# EAGLE schematic f103Ard (EAGLE 4.13)
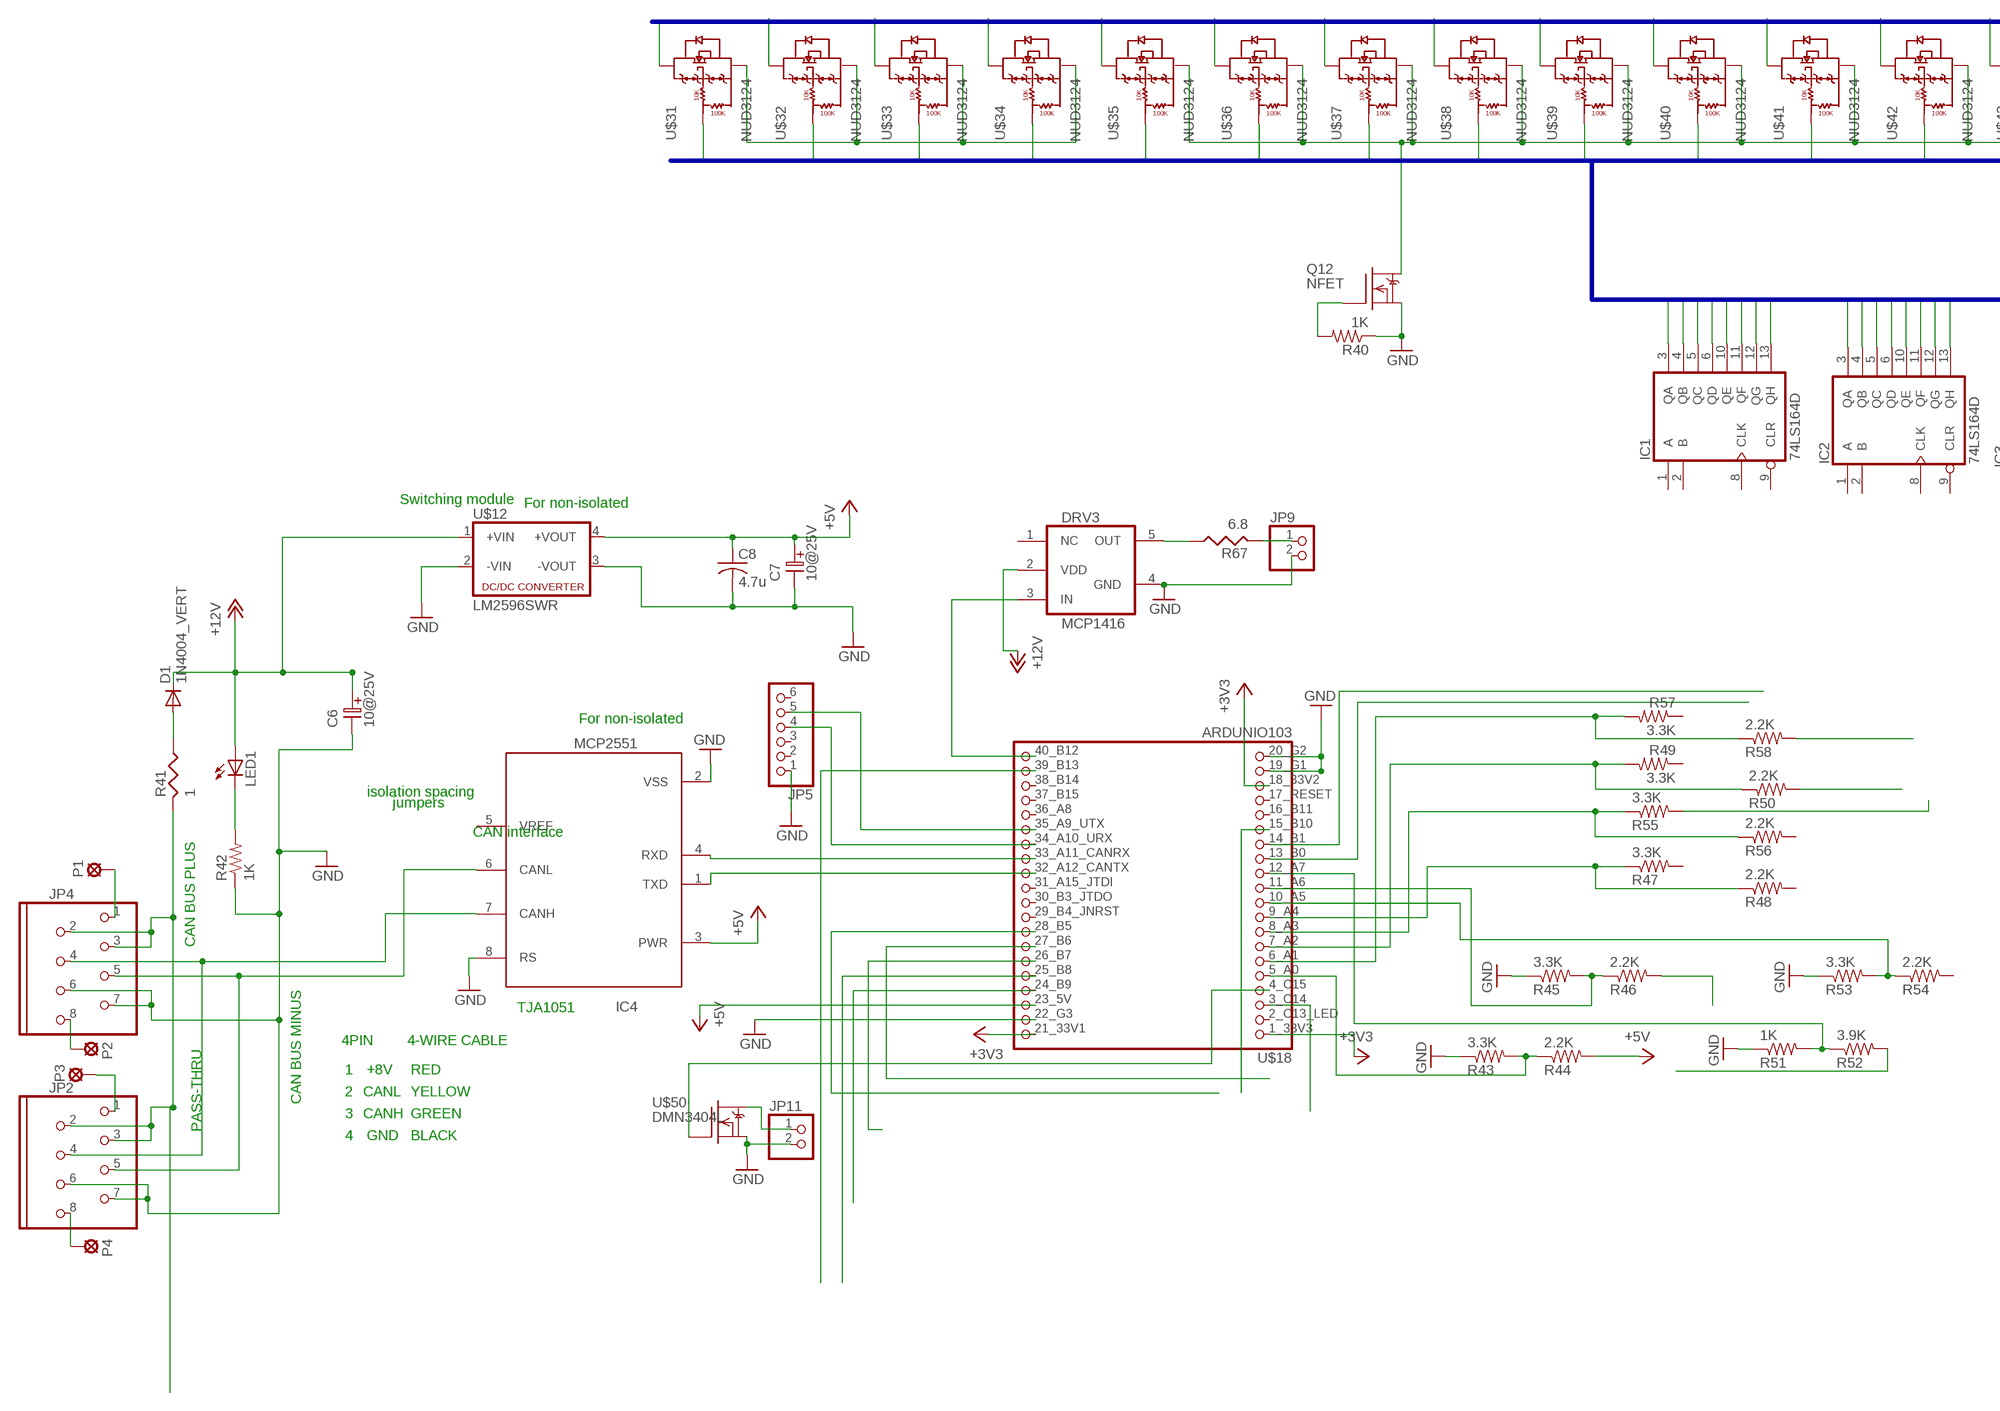
[diagram p0: schematic, sheet 1, part 1 of 2]
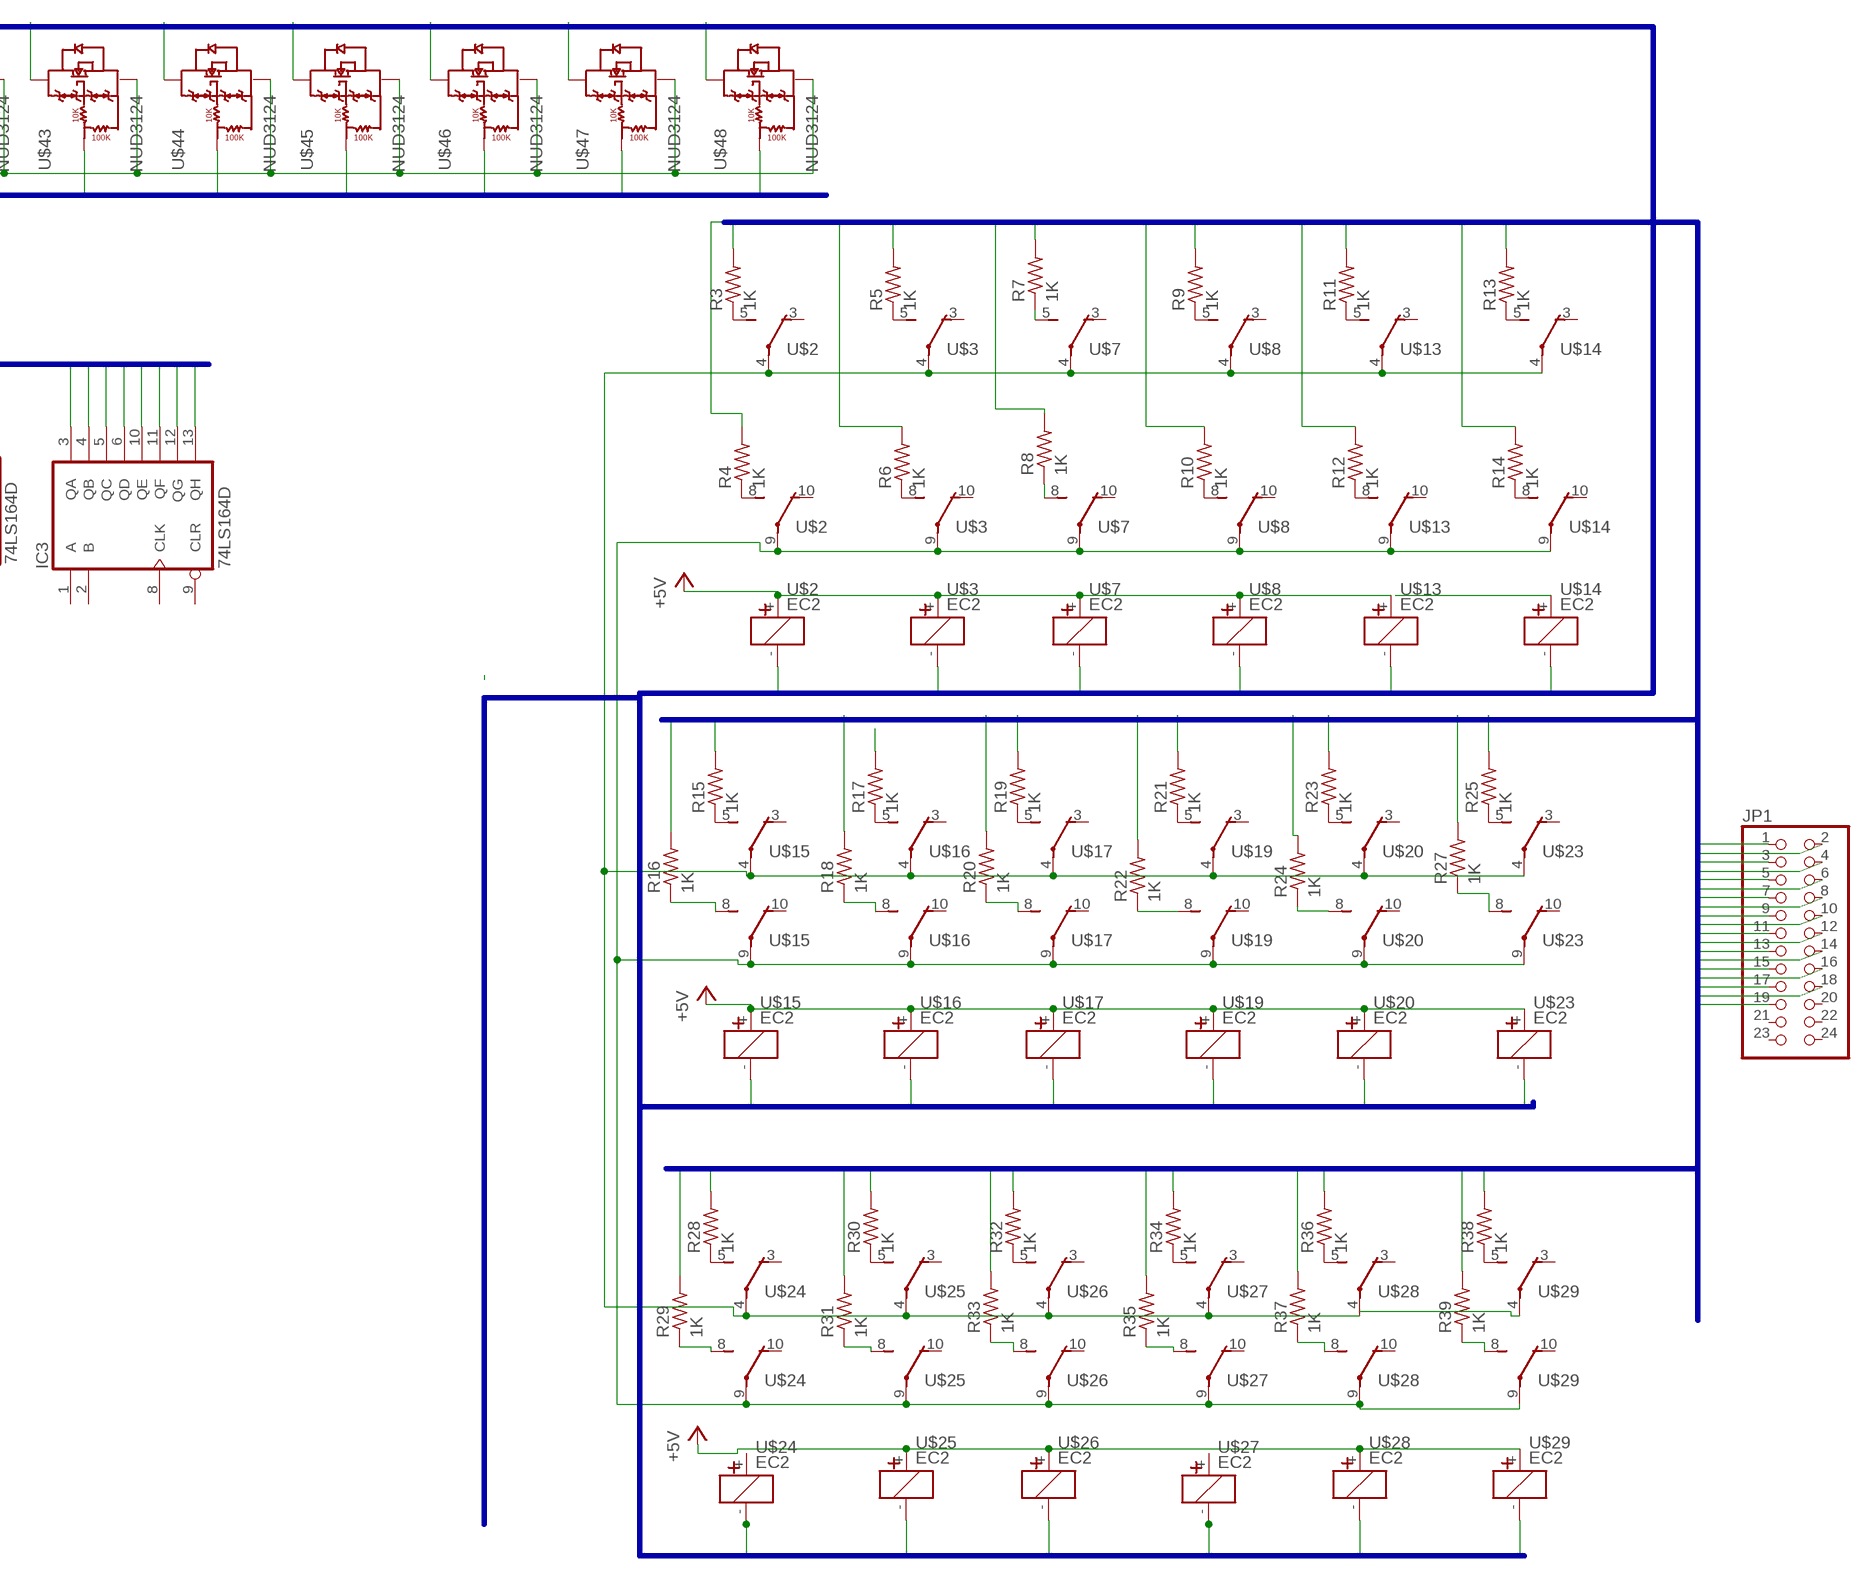
[diagram p1: schematic, sheet 1, part 2 of 2]

## Parts
C6  10@25V  ELC-2,5L  [ES-2,5L]
C7  10@25V  ELC-2,5L  [ES-2,5L]
C8  4.7u  C-USC0603  [C0603]
D1  1N4004_VERT  [DO41-10_VERT]
DRV3  MCP1416  [SOT23-5]
IC1  74LS164D  [SO14]
IC2  74LS164D  [SO14]
IC3  74LS164D  [SO14]
IC4  MCP2551  [SO-08]
JP1  PINHD-2X12  [2X12]
JP2  MOD8P8C  [MOD8P8C]
JP4  MOD8P8C  [MOD8P8C]
JP5  PINHD-1X6  [1X06]
JP9  PINHD-1X2  [1X02]
JP11  PINHD-1X2  [1X02]
LED1  LEDCHIPLED_0805  [CHIPLED_0805]
P1  SOLPAD035  [SOLDPAD035]
P2  SOLPAD035  [SOLDPAD035]
P3  SOLPAD035  [SOLDPAD035]
P4  SOLPAD035  [SOLDPAD035]
Q12  NFET  DMN3404L  [SOT-23]
R3  1K  R-US_R0603  [R0603]
R4  1K  R-US_R0603  [R0603]
R5  1K  R-US_R0603  [R0603]
R6  1K  R-US_R0603  [R0603]
R7  1K  R-US_R0603  [R0603]
R8  1K  R-US_R0603  [R0603]
R9  1K  R-US_R0603  [R0603]
R10  1K  R-US_R0603  [R0603]
R11  1K  R-US_R0603  [R0603]
R12  1K  R-US_R0603  [R0603]
R13  1K  R-US_R0603  [R0603]
R14  1K  R-US_R0603  [R0603]
R15  1K  R-US_R0603  [R0603]
R16  1K  R-US_R0603  [R0603]
R17  1K  R-US_R0603  [R0603]
R18  1K  R-US_R0603  [R0603]
R19  1K  R-US_R0603  [R0603]
R20  1K  R-US_R0603  [R0603]
R21  1K  R-US_R0603  [R0603]
R22  1K  R-US_R0603  [R0603]
R23  1K  R-US_R0603  [R0603]
R24  1K  R-US_R0603  [R0603]
R25  1K  R-US_R0603  [R0603]
R27  1K  R-US_R0603  [R0603]
R28  1K  R-US_R0603  [R0603]
R29  1K  R-US_R0603  [R0603]
R30  1K  R-US_R0603  [R0603]
R31  1K  R-US_R0603  [R0603]
R32  1K  R-US_R0603  [R0603]
R33  1K  R-US_R0603  [R0603]
R34  1K  R-US_R0603  [R0603]
R35  1K  R-US_R0603  [R0603]
R36  1K  R-US_R0603  [R0603]
R37  1K  R-US_R0603  [R0603]
R38  1K  R-US_R0603  [R0603]
R39  1K  R-US_R0603  [R0603]
R40  1K  R-US_R0603  [R0603]
R41  1  RESUS-S2,5  [RS-2,5]
R42  1K  R-US_R0603  [R0603]
R43  3.3K  R-US_R0603  [R0603]
R44  2.2K  R-US_R0603  [R0603]
R45  3.3K  R-US_R0603  [R0603]
R46  2.2K  R-US_R0603  [R0603]
R47  3.3K  R-US_R0603  [R0603]
R48  2.2K  R-US_R0603  [R0603]
R49  3.3K  R-US_R0603  [R0603]
R50  2.2K  R-US_R0603  [R0603]
R51  1K  R-US_R0603  [R0603]
R52  3.9K  R-US_R0603  [R0603]
R53  3.3K  R-US_R0603  [R0603]
R54  2.2K  R-US_R0603  [R0603]
R55  3.3K  R-US_R0603  [R0603]
R56  2.2K  R-US_R0603  [R0603]
R57  3.3K  R-US_R0603  [R0603]
R58  2.2K  R-US_R0603  [R0603]
R67  6.8  RESUS-S2,5  [RS-2,5]
U$2  EC2  [EC2]
U$3  EC2  [EC2]
U$7  EC2  [EC2]
U$8  EC2  [EC2]
U$12  LM2596SWR  [LM2596SW]
U$13  EC2  [EC2]
U$14  EC2  [EC2]
U$15  EC2  [EC2]
U$16  EC2  [EC2]
U$17  EC2  [EC2]
U$18  ARDUNIO103  [ARDUNIO103]
U$19  EC2  [EC2]
U$20  EC2  [EC2]
U$23  EC2  [EC2]
U$24  EC2  [EC2]
U$25  EC2  [EC2]
U$26  EC2  [EC2]
U$27  EC2  [EC2]
U$28  EC2  [EC2]
U$29  EC2  [EC2]
U$31  NUD3124  [SOT-23]
U$32  NUD3124  [SOT-23]
U$33  NUD3124  [SOT-23]
U$34  NUD3124  [SOT-23]
U$35  NUD3124  [SOT-23]
U$36  NUD3124  [SOT-23]
U$37  NUD3124  [SOT-23]
U$38  NUD3124  [SOT-23]
U$39  NUD3124  [SOT-23]
U$40  NUD3124  [SOT-23]
U$41  NUD3124  [SOT-23]
U$42  NUD3124  [SOT-23]
U$43  NUD3124  [SOT-23]
U$44  NUD3124  [SOT-23]
U$45  NUD3124  [SOT-23]
U$46  NUD3124  [SOT-23]
U$47  NUD3124  [SOT-23]
U$48  NUD3124  [SOT-23]
U$50  DMN3404L  [SOT-23]

## Nets
+3V3: U$18.1_33V3 U$18.18_33V2 U$18.21_33V1
+5V: C7.1 C8.1 IC4.3(PWR) R44.2 U$2.+ U$3.+ U$7.+ U$8.+ U$12.4(+VOUT) U$13.+ U$15.+ U$16.+ U$17.+ U$18.23_5V U$19.+ U$20.+ U$23.+ U$25.+ U$26.+ U$28.+ U$29.+
+12V: C6.1 D1.C DRV3.2(VDD) LED1.A U$12.1(+VIN)
+12V_RESISTORED1: D1.A R41.1
A1: R43.2 R44.1 U$18.5_A0
A2: R57.2 R58.1 U$18.6_A1
A3: R49.2 R50.1 U$18.7_A2
A3BIAS: R55.2
A4: R55.1 R56.1 U$18.8_A3
A5: R47.1 R48.1 U$18.9_A4
A6: R53.2 R54.1 U$18.10_A5
A8: R45.2 R46.1 U$18.11_A6
A9: R51.2 R52.1 U$18.12_A7
B0: U$18.13_B0
B2: U$18.14_B1
B3: U$18.26_B7
B4: U$18.25_B8
B6: U$18.27_B6
B10: U$18.24_B9
B11: U$18.15_B10
B12DRV: DRV3.5(OUT) R67.1
B12DRVOUT: JP9.1 R67.2
B13: DRV3.3(IN) U$18.40_B12
B14: U$18.39_B13
B15: U$18.28_B5
C1: U$18.3_C14
C2: U$18.4_C15 U$50.1(G)
CAN_RAW_PLUS1: JP2.2 JP2.3 JP4.2 JP4.3 R41.2
CANCABLE_1_2: JP4.1 P1.MP
CANCABLE_1_3: JP4.8 P2.MP
CANCABLE_2_2: JP2.1 P3.MP
CANCABLE_2_3: JP2.8 P4.MP
CANRX1: IC4.4(RXD) U$18.33_A11_CANRX
CANTX1: IC4.1(TXD) U$18.32_A12_CANTX
D1: IC1.3(QA) U$31.1
D2: IC1.4(QB) U$32.1
D3: IC1.5(QC) U$33.1
D4: IC1.6(QD) U$34.1
D5: IC1.10(QE) U$35.1
D6: IC1.11(QF) U$36.1
D7: IC1.12(QG) U$37.1
D8: IC1.13(QH) U$38.1
D9: IC2.3(QA) U$39.1
D10: IC2.4(QB) U$40.1
D11: IC2.5(QC) U$41.1
D12: IC2.6(QD) U$42.1
D13: IC2.10(QE) U$43.1
D14: IC2.11(QF) U$44.1
D15: IC2.12(QG) U$45.1
D16: IC2.13(QH) U$46.1
D17: IC3.3(QA) U$47.1
D18: IC3.4(QB) U$48.1
D19: IC3.5(QC)
D20: IC3.6(QD)
D21: IC3.10(QE)
D22: IC3.11(QF)
D23: IC3.12(QG)
D24: IC3.13(QH)
DIV1: R58.2
GND: C6.2 C7.2 C8.2 DRV3.4(GND) IC4.2(VSS) IC4.8(RS) JP2.6 JP2.7 JP4.6 JP4.7 JP5.1 JP9.2 JP11.2 Q12.2(S) R40.1 R42.1 R43.1 R45.1 R51.1 R53.1 U$12.2(-VIN) U$12.3(-VOUT) U$18.19_G1 U$18.20_G2 U$18.22_G3 U$50.2(S)
KA1: U$2.- U$31.3
KA2: U$3.- U$32.3
KA3: U$7.- U$33.3
KA4: U$8.- U$34.3
KA5: U$13.- U$35.3
KA6: U$14.- U$36.3
KA7: U$15.- U$37.3
KA8: U$16.- U$38.3
KA9: U$17.- U$39.3
KA10: U$19.- U$40.3
KA11: U$20.- U$41.3
KA12: U$23.- U$42.3
KA13: U$24.- U$43.3
KA14: U$25.- U$44.3
KA15: U$26.- U$45.3
KA16: U$27.- U$46.3
KA17: U$28.- U$47.3
KA18: U$29.- U$48.3
LED_BUS_PWR1: LED1.C R42.2
MCP2551_CANH1: IC4.7(CANH) JP2.4 JP4.4
MCP2551_CANL1: IC4.6(CANL) JP2.5 JP4.5
MINUS: U$2.9(P) U$3.9(P) U$7.9(P) U$8.9(P) U$13.9(P) U$14.9(P) U$15.9(P) U$16.9(P) U$17.9(P) U$19.9(P) U$20.9(P) U$23.9(P) U$24.9(P) U$25.9(P) U$26.9(P) U$27.9(P) U$28.9(P) U$29.9(P)
N$1: R3.1 U$2.5(S)
N$2: R4.1 U$2.8(S)
N$3: R5.1 U$3.5(S)
N$4: U$14.+
N$5: R6.1 U$3.8(S)
N$6: R52.2
N$7: R9.1 U$8.5(S)
N$9: R10.1 U$8.8(S)
N$10: R11.1 U$13.5(S)
N$12: R12.1 U$13.8(S)
N$14: R13.1 U$14.5(S)
N$16: R14.1 U$14.8(S)
N$17: R7.1 U$7.5(S)
N$18: R15.1 U$15.5(S)
N$19: R8.1 U$7.8(S)
N$20: R17.1 U$16.5(S)
N$21: R19.1 U$17.5(S)
N$22: R21.1 U$19.5(S)
N$23: R23.1 U$20.5(S)
N$24: R25.1 U$23.5(S)
N$25: R28.1 U$24.5(S)
N$26: R30.1 U$25.5(S)
N$27: R16.1 U$15.8(S)
N$28: R18.1 U$16.8(S)
N$30: R20.1 U$17.8(S)
N$31: R22.1 U$19.8(S)
N$32: R24.1 U$20.8(S)
N$33: R27.1 U$23.8(S)
N$34: R32.1 U$26.5(S)
N$35: R34.1 U$27.5(S)
N$36: R36.1 U$28.5(S)
N$37: R38.1 U$29.5(S)
N$38: Q12.3(D) U$35.2 U$36.2 U$37.2 U$38.2 U$39.2 U$40.2 U$41.2 U$42.2 U$43.2 U$44.2 U$45.2 U$46.2 U$47.2 U$48.2
N$39: U$31.2 U$32.2 U$33.2 U$34.2
N$40: Q12.1(G) R40.2
N$42: R29.1 U$24.8(S)
N$43: R31.1 U$25.8(S)
N$44: R33.1 U$26.8(S)
N$45: R35.1 U$27.8(S)
N$46: R37.1 U$28.8(S)
N$47: R39.1 U$29.8(S)
N$48: JP11.1 U$50.3(D)
N$49: U$29.4(P)
N$51: R46.2
N$53: R50.2
PA9_USART1_TX1: JP5.5 U$18.35_A9_UTX
PA10_USART1_RX1: JP5.4 U$18.34_A10_URX
PLUS: U$2.4(P) U$3.4(P) U$7.4(P) U$8.4(P) U$13.4(P) U$14.4(P) U$15.4(P) U$16.4(P) U$17.4(P) U$19.4(P) U$20.4(P) U$23.4(P) U$24.4(P) U$25.4(P) U$26.4(P) U$27.4(P) U$28.4(P)
PLUS0: JP1.1 R4.2
PLUS1: JP1.2 R3.2 R6.2
PLUS2: JP1.3 R5.2
PLUS3: JP1.4 R7.2 R8.2 R10.2
PLUS4: JP1.5 R9.2 R12.2
PLUS5: JP1.6 R11.2 R14.2
PLUS6: JP1.7 R13.2 R16.2
PLUS7: JP1.8 R15.2 R18.2
PLUS8: JP1.9 R17.2 R20.2
PLUS9: JP1.10 R19.2 R22.2
PLUS10: JP1.11 R21.2 R24.2
PLUS11: JP1.12 R23.2 R27.2
PLUS12: JP1.13 R25.2 R29.2
PLUS13: JP1.14 R28.2 R31.2
PLUS14: JP1.15 R30.2 R33.2
PLUS15: JP1.16 R32.2 R35.2
PLUS16: JP1.17 R34.2 R37.2
PLUS17: JP1.18 R36.2 R39.2
PLUS18: JP1.19 R38.2
Unconnected: DRV3.1(NC) IC1.1(A) IC1.2(B) IC1.8(CLK) IC1.9(CLR) IC2.1(A) IC2.2(B) IC2.8(CLK) IC2.9(CLR) IC3.1(A) IC3.2(B) IC3.8(CLK) IC3.9(CLR) IC4.5(VREF) JP1.20 JP1.21 JP1.22 JP1.23 JP1.24 JP5.2 JP5.3 JP5.6 R47.2 R48.2 R49.1 R54.2 R56.2 R57.1 U$2.3(O) U$2.10(O) U$3.3(O) U$3.10(O) U$7.3(O) U$7.10(O) U$8.3(O) U$8.10(O) U$13.3(O) U$13.10(O) U$14.3(O) U$14.10(O) U$15.3(O) U$15.10(O) U$16.3(O) U$16.10(O) U$17.3(O) U$17.10(O) U$18.2_C13_LED U$18.16_B11 U$18.17_RESET U$18.29_B4_JNRST U$18.30_B3_JTDO U$18.31_A15_JTDI U$18.36_A8 U$18.37_B15 U$18.38_B14 U$19.3(O) U$19.10(O) U$20.3(O) U$20.10(O) U$23.3(O) U$23.10(O) U$24.3(O) U$24.10(O) U$24.+ U$25.3(O) U$25.10(O) U$26.3(O) U$26.10(O) U$27.3(O) U$27.10(O) U$27.+ U$28.3(O) U$28.10(O) U$29.3(O) U$29.10(O)

## Buses
KA[1..18]
PLUS[0..18]
D[1..24]

## Notes on the sheet
- Switching module | For non-isolated
- For non-isolated
- isolation spacing
- jumpers
- CAN interface
- CAN BUS PLUS
- TJA1051
- PASS-THRU | 4PIN | 4-WIRE CABLE
- 1 | +8V | RED
- 2 | CANL | YELLOW
- CAN BUS MINUS
- 3 | CANH | GREEN
- 4 | GND | BLACK

## Power pins joined to a net without a drawn wire
GND: IC1.7(GND) IC2.7(GND) IC3.7(GND)
VCC: IC1.14(VCC) IC2.14(VCC) IC3.14(VCC)

## Library data of the parts
C6 C7 = DEH:ELC-2,5L
C8 = rcl:C-US: CAPACITOR, American symbol
D1 = diode:1N4004_VERT
DRV3 = DEH:MCP1416
IC1-IC3 = 74xx-us:74*164: 8-bit parallel out SHIFT REGISTER
IC4 = texas:MCP2551
JP1 = pinhead:PINHD-2X12: PIN HEADER
JP2 JP4 = DEH:MOD8P8C
JP5 = pinhead:PINHD-1X6: PIN HEADER
JP9 JP11 = pinhead:PINHD-1X2: PIN HEADER
LED1 = led:LED: LED OSRAM: - CHIPLED LG R971, LG N971, LY N971, LG Q971, LY Q971, LO R971, LY R971 LH N974, LH R974 LS Q976, LO Q976, LY Q976 LO Q996 - Hyper CHIPLED LW Q18S LB Q993, LB Q99A, LB R99A - SideLED LS A670, LO A670, LY A670, LG A670, LP A670 LB A673, LV A673, LT A673, LW A673 LH A674 LY A675 LS A676, LA A676, LO A676, LY A676, LW A676 LS A679, LY A679, LG A679 - Hyper Micro SIDELED® LS Y876, LA Y876, LO Y876, LY Y876 LT Y87S - SmartLED LW L88C, LW L88S LB L89C, LB L89S, LG L890 LS L89K, LO L89K, LY L89K LS L896, LA L896, LO L896, LY L896 - TOPLED LS T670, LO T670, LY T670, LG T670, LP T670 LSG T670, LSP T670, LSY T670, LOP T670, LYG T670 LG T671, LOG T671, LSG T671 LB T673, LV T673, LT T673, LW T673 LH T674 LS T676, LA T676, LO T676, LY T676, LB T676, LH T676, LSB T676, LW T676 LB T67C, LV T67C, LT T67C, LS T67K, LO T67K, LY T67K, LW E67C LS E67B, LA E67B, LO E67B, LY E67B, LB E67C, LV E67C, LT E67C LW T67C LS T679, LY T679, LG T679 LS T770, LO T770, LY T770, LG T770, LP T770 LB T773, LV T773, LT T773, LW T773 LH T774 LS E675, LA E675, LY E675, LS T675 LS T776, LA T776, LO T776, LY T776, LB T776 LHGB T686 LT T68C, LB T68C - Hyper Mini TOPLED® LB M676 - Mini TOPLED Santana® LG M470 LS M47K, LO M47K, LY M47K Source: http://www.osram.convergy.de/
P1-P4 = solpad:SOLPAD035
Q12 U$50 = transistor-fet:DMN3404L
R3-R25 R27-R40 R42-R58 = rcl:R-US_: RESISTOR, American symbol
R41 R67 = DEH:RESUS-S2,5
U$2 U$3 U$7 U$8 U$13-U$17 U$19 U$20 U$23-U$29 = relay:EC2
U$12 = dc-dc-converter:LM2596SWR
U$18 = pinhead:ARDUNIO103
U$31-U$48 = DEH:NUD3124